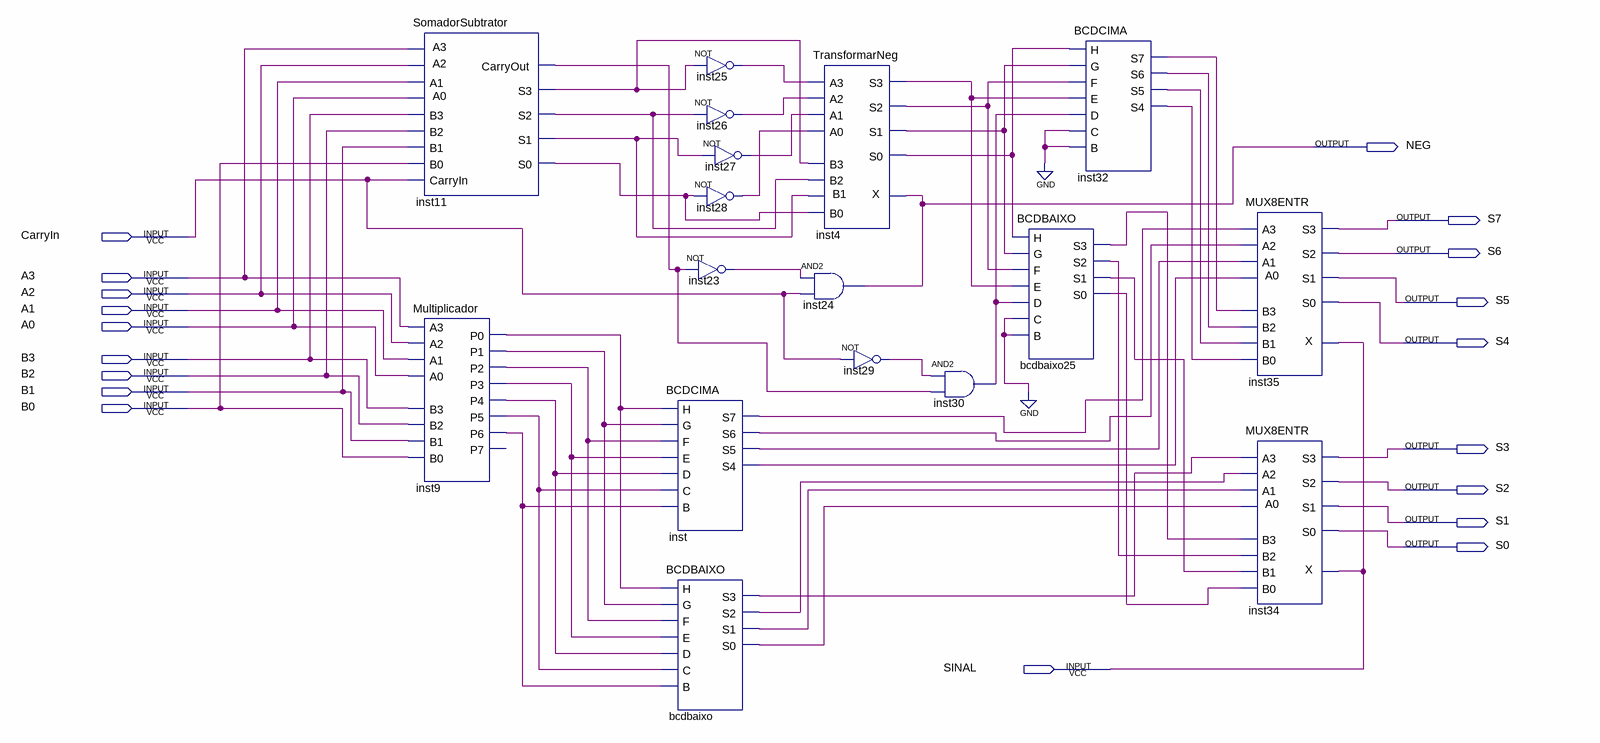
[diagram p0: schematic sheet]
// Quartus schematic ULA.bdf as structural Verilog: 17 symbols, 19 pins
module ULA (
  input  CarryIn,
  input  A3,
  input  A2,
  input  A1,
  input  A0,
  input  B3,
  input  B2,
  input  B1,
  input  B0,
  input  SINAL,
  output NEG,
  output S7,
  output S6,
  output S5,
  output S4,
  output S3,
  output S2,
  output S1,
  output S0
);

  wire bcdbaixo25_s0, bcdbaixo25_s1, bcdbaixo25_s2, bcdbaixo25_s3, bcdbaixo_s0, bcdbaixo_s1, bcdbaixo_s2,
       bcdbaixo_s3, inst4_s0, inst4_s1, inst4_s2, inst4_s3, inst9_p0, inst9_p1, inst9_p2, inst9_p3, inst9_p4,
       inst9_p5, inst9_p6, inst11_carryout, inst11_s0, inst11_s1, inst11_s2, inst11_s3, inst23_out,
       inst25_out, inst26_out, inst27_out, inst28_out, inst29_out, inst30_out, inst32_s4, inst32_s5,
       inst32_s6, inst32_s7, inst_s4, inst_s5, inst_s6, inst_s7;

  SomadorSubtrator inst11 (
    .B0(B0), .B1(B1), .B2(B2), .B3(B3), .A1(A1), .A0(A0), .A2(A2), .A3(A3), .CarryIn(CarryIn),
    .S1(inst11_s1), .S2(inst11_s2), .S0(inst11_s0), .S3(inst11_s3), .CarryOut(inst11_carryout));
  Multiplicador inst9 (
    .A0(A0), .A2(A2), .A3(A3), .A1(A1), .B0(B0), .B1(B1), .B2(B2), .B3(B3), .P0(inst9_p0), .P1(inst9_p1),
    .P2(inst9_p2), .P3(inst9_p3), .P4(inst9_p4), .P6(inst9_p6), .P5(inst9_p5));  // open: P7
  not inst23 (inst23_out, inst11_carryout);
  BCDCIMA inst (
    .B(inst9_p6), .D(inst9_p4), .F(inst9_p2), .G(inst9_p1), .H(inst9_p0), .C(inst9_p5), .E(inst9_p3),
    .S7(inst_s7), .S6(inst_s6), .S5(inst_s5), .S4(inst_s4));
  BCDBAIXO bcdbaixo (
    .B(inst9_p6), .D(inst9_p4), .F(inst9_p2), .G(inst9_p1), .H(inst9_p0), .C(inst9_p5), .E(inst9_p3),
    .S3(bcdbaixo_s3), .S2(bcdbaixo_s2), .S1(bcdbaixo_s1), .S0(bcdbaixo_s0));
  not inst25 (inst25_out, inst11_s3);
  not inst26 (inst26_out, inst11_s2);
  not inst27 (inst27_out, inst11_s1);
  not inst28 (inst28_out, inst11_s0);
  TransformarNeg inst4 (
    .A0(inst28_out), .X(NEG), .B0(inst11_s0), .A1(inst27_out), .B1(inst11_s1), .A2(inst26_out),
    .B2(inst11_s2), .A3(inst25_out), .B3(inst11_s3), .S3(inst4_s3), .S2(inst4_s2), .S1(inst4_s1),
    .S0(inst4_s0));
  and inst24 (NEG, inst23_out, CarryIn);
  not inst29 (inst29_out, CarryIn);
  and inst30 (inst30_out, inst29_out, inst11_carryout);
  BCDBAIXO bcdbaixo25 (
    .B(1'b0), .D(inst30_out), .F(inst4_s2), .G(inst4_s1), .H(inst4_s0), .C(1'b0), .E(inst4_s3),
    .S3(bcdbaixo25_s3), .S2(bcdbaixo25_s2), .S1(bcdbaixo25_s1), .S0(bcdbaixo25_s0));
  BCDCIMA inst32 (
    .B(1'b0), .D(inst30_out), .F(inst4_s2), .G(inst4_s1), .H(inst4_s0), .C(1'b0), .E(inst4_s3),
    .S7(inst32_s7), .S6(inst32_s6), .S5(inst32_s5), .S4(inst32_s4));
  MUX8ENTR inst35 (
    .A0(inst_s4), .X(SINAL), .B0(inst32_s4), .A1(inst_s5), .B1(inst32_s5), .A2(inst_s6), .B2(inst32_s6),
    .A3(inst_s7), .B3(inst32_s7), .S0(S4), .S1(S5), .S2(S6), .S3(S7));
  MUX8ENTR inst34 (
    .A0(bcdbaixo_s0), .X(SINAL), .B0(bcdbaixo25_s0), .A1(bcdbaixo_s1), .B1(bcdbaixo25_s1), .A2(bcdbaixo_s2),
    .B2(bcdbaixo25_s2), .A3(bcdbaixo_s3), .B3(bcdbaixo25_s3), .S0(S0), .S1(S1), .S2(S2), .S3(S3));
endmodule
